# Altium schematic sheet PDM_ROCKPIS_PoE_HAT_FPC.SchDoc
size A3
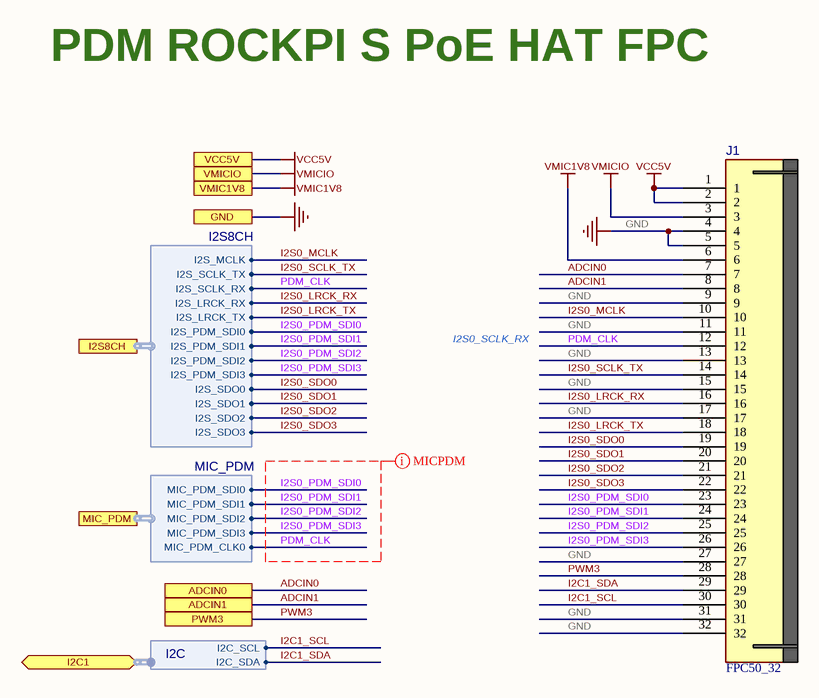
[diagram p0: PDM_ROCKPIS_PoE_HAT_FPC.SchDoc]

## Parts
J1  FPC50_32  [FPC50_32D]

## Ports
ADCIN0, ADCIN1, GND, I2C1 (bidir, harness I2C), I2S8CH (harness I2S8CH), MIC_PDM (harness MIC_PDM), PWM3, VCC5V, VMIC1V8, VMICIO

## Harnesses
MIC_PDM: MIC_PDM_SDI0, MIC_PDM_SDI1, MIC_PDM_SDI2, MIC_PDM_SDI3, MIC_PDM_CLK0
I2S8CH: I2S_MCLK, I2S_SCLK_TX, I2S_SCLK_RX, I2S_LRCK_RX, I2S_LRCK_TX, I2S_PDM_SDI0, I2S_PDM_SDI1, I2S_PDM_SDI2, I2S_PDM_SDI3, I2S_SDO0, I2S_SDO1, I2S_SDO2, I2S_SDO3
I2C: I2C_SCL, I2C_SDA

## Nets
GND: J1.4 J1.5 J1.9 J1.11 J1.13 J1.15 J1.17 J1.27 J1.31 J1.32 ; port GND
VCC5V: J1.1 J1.2 ; port VCC5V
VMIC1V8: J1.6 ; port VMIC1V8
VMICIO: J1.3 ; port VMICIO
ADCIN0: J1.7 ; port ADCIN0
ADCIN1: J1.8 ; port ADCIN1
I2C1_SCL: J1.30 ; port I2C1.I2C_SCL
I2C1_SDA: J1.29 ; port I2C1.I2C_SDA
I2S0_LRCK_RX: J1.16 ; port I2S8CH.I2S_LRCK_RX
I2S0_LRCK_TX: J1.18 ; port I2S8CH.I2S_LRCK_TX
I2S0_MCLK: J1.10 ; port I2S8CH.I2S_MCLK
I2S0_PDM_SDI0: J1.23 ; port MIC_PDM.MIC_PDM_SDI0, port I2S8CH.I2S_PDM_SDI0
I2S0_PDM_SDI1: J1.24 ; port MIC_PDM.MIC_PDM_SDI1, port I2S8CH.I2S_PDM_SDI1
I2S0_PDM_SDI2: J1.25 ; port MIC_PDM.MIC_PDM_SDI2, port I2S8CH.I2S_PDM_SDI2
I2S0_PDM_SDI3: J1.26 ; port MIC_PDM.MIC_PDM_SDI3, port I2S8CH.I2S_PDM_SDI3
I2S0_SCLK_TX: J1.14 ; port I2S8CH.I2S_SCLK_TX
I2S0_SDO0: J1.19 ; port I2S8CH.I2S_SDO0
I2S0_SDO1: J1.20 ; port I2S8CH.I2S_SDO1
I2S0_SDO2: J1.21 ; port I2S8CH.I2S_SDO2
I2S0_SDO3: J1.22 ; port I2S8CH.I2S_SDO3
PDM_CLK: J1.12 ; port MIC_PDM.MIC_PDM_CLK0, port I2S8CH.I2S_SCLK_RX
PWM3: J1.28 ; port PWM3

## Layout directives
net class MICPDM: I2S0_PDM_SDI0, I2S0_PDM_SDI1, I2S0_PDM_SDI2, I2S0_PDM_SDI3, PDM_CLK

## Notes on the sheet
- PDM ROCKPI S PoE HAT FPC
- I2S0_SCLK_RX

## Library data of the parts
J1 = FPC50_32D: CONN, FPC, 0.50mm pitch, RightAngle, Bot. Contact; MANF: OMRON; MANF_P#: XF2M-3215-1A; VALUE: FPC50_32